# Altium project Schematic.PrjPcb
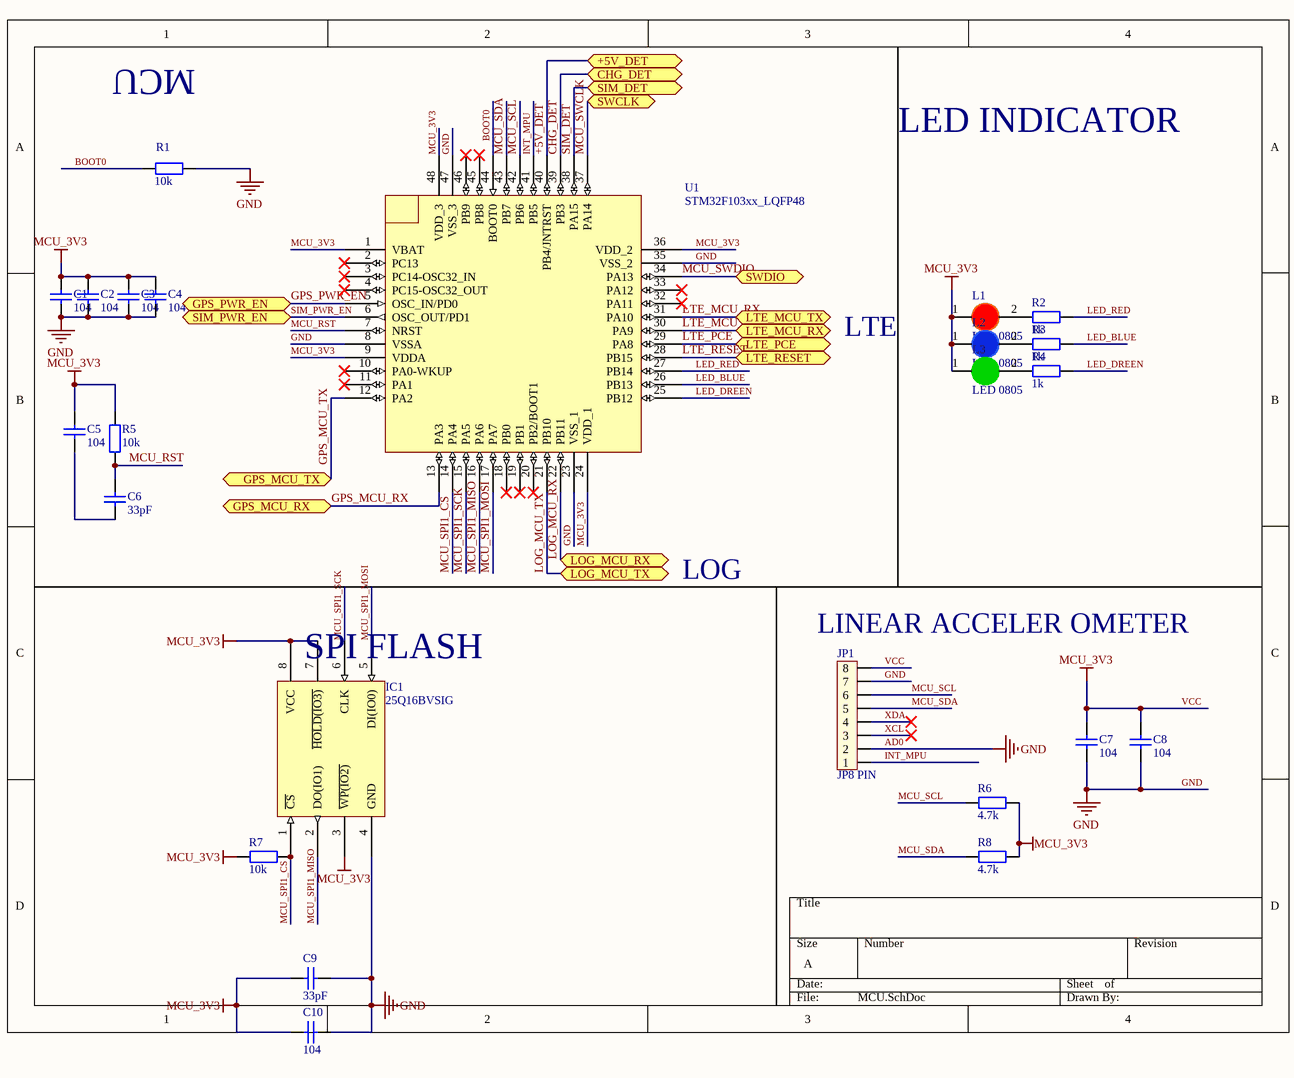
[diagram p0: MCU.SchDoc]
3 sheets, 85 parts. Net scope: flat (ports and power ports of the same name join across sheets).
Board file: PCB1.PcbDoc
Sheets:
  MCU.SchDoc
  LTE,GPS.SchDoc
  PSU - BUCK, LDO, CHARGER.SchDoc

## Sheet MCU.SchDoc
size A; SheetNumber: 1; SheetTotal: 3

### Parts
C1  104  [tu 0805]
C2  104  [tu 0805]
C3  104  [tu 0805]
C4  104  [tu 0805]
C5  104  [tu 0805]
C6  33pF  [tu 0805]
C7  104  [tu 0805]
C8  104  [tu 0805]
C9  33pF  [tu 0805]
C10  104  [tu 0805]
IC1  25Q16BVSIG  [SOP127P790X195-8N]
JP1  JP8 PIN  [JP8]
L1  LED 0805  [LED-0805-Red]
L2  LED 0805  [LED-0805-Blue]
L3  LED 0805  [LED-0805-Green]
R1  10k  [tro smd 0805]
R2  1k  [tro smd 0805]
R3  1k  [tro smd 0805]
R4  1k  [tro smd 0805]
R5  10k  [tro smd 0805]
R6  4.7k  [tro smd 0805]
R7  10k  [tro smd 0805]
R8  4.7k  [tro smd 0805]
U1  STM32F103xx_LQFP48  [STM32_LQPF48]

### Ports
+5V_DET (bidir), CHG_DET (bidir), GPS_MCU_RX (bidir), GPS_MCU_TX (bidir), GPS_PWR_EN (bidir), LOG_MCU_RX (bidir), LOG_MCU_TX (bidir), LTE_MCU_RX (bidir), LTE_MCU_TX (bidir), LTE_PCE (bidir), LTE_RESET (bidir), SIM_DET (bidir), SIM_PWR_EN (bidir), SWCLK (bidir), SWDIO (bidir)

### Nets
AD0: C1.1 C2.1 C3.1 C4.1 C7.1 C8.1 C9.2 C10.1 IC1.4(GND) JP1.2 JP1.7 R1.1 U1.8(VSSA) U1.23(VSS_1) U1.35(VSS_2) U1.47(VSS_3)  [also labelled GND]
MCU_3V3: C1.2 C2.2 C3.2 C4.2 C5.2 C7.2 C8.2 C9.1 C10.2 IC1.3(~{WP(IO2)}) IC1.7(~{HOLD(IO3)}) IC1.8(VCC) JP1.8 L1.1(A) L2.1(A) L3.1(A) R5.2 R6.2 R7.2 R8.2 U1.1(VBAT) U1.9(VDDA) U1.24(VDD_1) U1.36(VDD_2) U1.48(VDD_3)  [also labelled VCC]
+5V_DET: U1.40(PB4/JNTRST) ; port +5V_DET
BOOT0: R1.2 U1.44(BOOT0)
CHG_DET: U1.39(PB3) ; port CHG_DET
GPS_MCU_RX: U1.13(PA3) ; port GPS_MCU_RX
GPS_MCU_TX: U1.12(PA2) ; port GPS_MCU_TX
GPS_PWR_EN: U1.5(OSC_IN/PD0) ; port GPS_PWR_EN
INT_MPU: JP1.1 U1.41(PB5)
LED_BLUE: R3.2 U1.26(PB13)
LED_DREEN: R4.2 U1.25(PB12)
LED_RED: R2.2 U1.27(PB14)
LOG_MCU_RX: U1.22(PB11) ; port LOG_MCU_RX
LOG_MCU_TX: U1.21(PB10) ; port LOG_MCU_TX
LTE_MCU_RX: U1.31(PA10) ; port LTE_MCU_TX
LTE_MCU_TX: U1.30(PA9) ; port LTE_MCU_RX
LTE_PCE: U1.29(PA8) ; port LTE_PCE
LTE_RESET: U1.28(PB15) ; port LTE_RESET
MCU_RST: C6.1 R5.1 U1.7(NRST)
MCU_SCL: JP1.6 R6.1 U1.42(PB6)
MCU_SDA: JP1.5 R8.1 U1.43(PB7)
MCU_SPI1_CS: IC1.1(~{CS}) R7.1 U1.14(PA4)
MCU_SPI1_MISO: IC1.2(DO(IO1)) U1.16(PA6)
MCU_SPI1_MOSI: IC1.5(DI(IO0)) U1.17(PA7)
MCU_SPI1_SCK: IC1.6(CLK) U1.15(PA5)
MCU_SWCLK: U1.37(PA14) ; port SWCLK
MCU_SWDIO: U1.34(PA13) ; port SWDIO
SIM_DET: U1.38(PA15) ; port SIM_DET
SIM_PWR_EN: U1.6(OSC_OUT/PD1) ; port SIM_PWR_EN
XCL: JP1.3
XDA: JP1.4
NetC5_1: C5.1 C6.2
NetL1_2: L1.2(K) R2.1
NetL2_2: L2.2(K) R3.1
NetL3_2: L3.2(K) R4.1

Not connected (* = marked no-connect by the designer): U1 2(PC13)* 3(PC14-OSC32_IN)* 4(PC15-OSC32_OUT)* 10(PA0-WKUP)* 11(PA1)* 18(PB0)* 19(PB1)* 20(PB2/BOOT1)* 32(PA11)* 33(PA12)* 45(PB8)* 46(PB9)*

### Notes on the sheet
- MCU
- LED INDICATOR
- LTE
- LOG
- (near JP1) LINEAR ACCELER OMETER
- (near IC1) SPI FLASH

### Library data of the parts
C1-C5 C7 C8 C10 = Tu 0805 104 50V 10%: Dán; Don_Vi: Con; So_Chan: 2; Ten_Linh_Kien: Tụ 0805 104-100nF 10% 50V; Ma_Hang: MH004551; Chung_Loai: Dán; Kieu_Chan: *
C6 C9 = Tu 0805 33pF 50V 10%: Dán; Don_Vi: Con; So_Chan: 2; Ten_Linh_Kien: Tụ 0805 33p 10% 50V; Ma_Hang: MH004563; Chung_Loai: Dán; Kieu_Chan: *
JP1 = JP8: Value: JP7
L1 = LED 0805 Do: Dán; Don_Vi: Con; Ma_Hang: MH000897; Ten_Linh_Kien: LED 0805 Màu Đỏ (Red); Ghi_Chu: *; Kieu_Chan: *; Chung_Loai: Dán
L2 = LED 0805 Xanh Duong: Dán; Don_Vi: Con; Ma_Hang: MH002327; Ten_Linh_Kien: LED 0805 Màu Xanh Dương (Blue); Ghi_Chu: *; Kieu_Chan: *; Chung_Loai: Dán
L3 = LED 0805 Xanh La: Dán; Don_Vi: Con; Ma_Hang: MH002326; Ten_Linh_Kien: LED 0805 Màu Xanh Lá (Green); Ghi_Chu: *; Kieu_Chan: *; Chung_Loai: Dán
R1 R5 R7 = Tro 0805 5% 10k: Dán; Don_Vi: Con; So_Chan: 2; Ten_Linh_Kien: Trở 0805 5% 10k; Ma_Hang: MH005239; Chung_Loai: Dán; Kieu_Chan: *
R2-R4 = Tro 0805 5% 1k: Dán; Don_Vi: Con; So_Chan: 2; Ten_Linh_Kien: Trở 0805 5% 1k; Ma_Hang: MH005234; Chung_Loai: Dán; Kieu_Chan: *
R6 R8 = Tro 0805 5% 4.7k: Dán; Don_Vi: Con; So_Chan: 2; Ten_Linh_Kien: Trở 0805 5% 4.7k; Ma_Hang: MH005307; Chung_Loai: Dán; Kieu_Chan: *
U1 = STM32F103xx_LQFP48: Published: 30-May-2008; DatasheetVersion: rev6, Mar-2008; PackageVersion: Mar-2008; PackageReference: LQFP48; Publisher: Altium Limited; PackageDescription: 48-Pin Low-Profile Quad Flat Pack, 7 x 7 mm Body, 0.5 mm Pitch (LQFP48); ComponentLink1Description: Manufacturer Link; ComponentLink1URL: www.st.com/stm32; ComponentLink2Description: Datasheet; ComponentLink2URL: http://www.st.com/stonline/products/literature/ds/13587.pdf

## Sheet LTE,GPS.SchDoc
size A; SheetNumber: 2; SheetTotal: 3
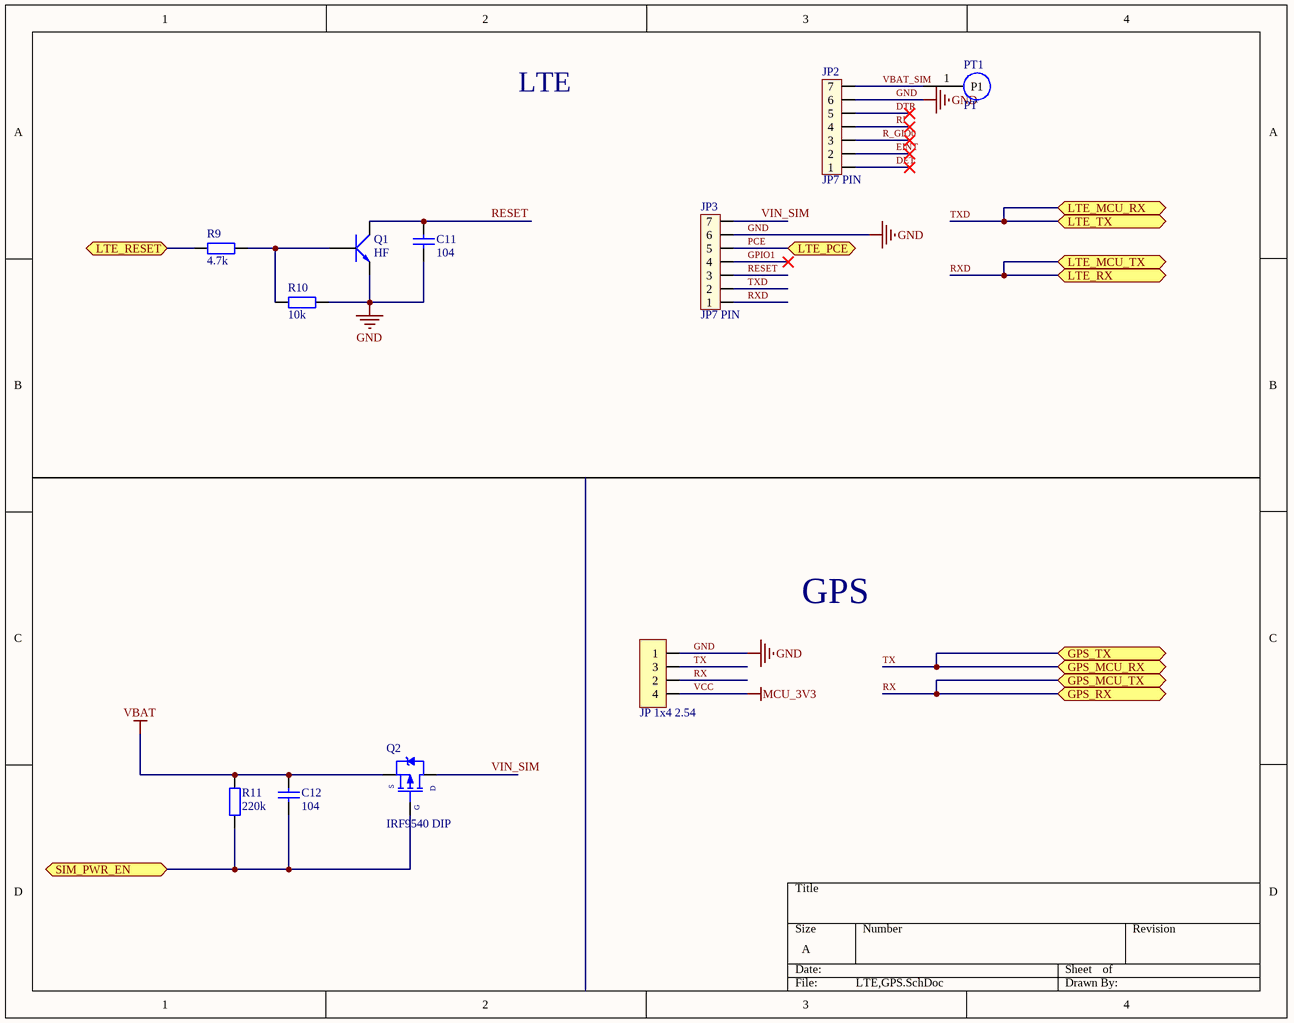
[diagram p1: LTE,GPS.SchDoc]

### Parts
C11  104  [tu 0805]
C12  104  [tu 0805]
JP2  JP7 PIN  [JP7]
JP3  JP7 PIN  [JP7]
JP4  JP 1x4 2.54  [JP 1x4 DC]
PT1  PT  [Test pont]  (no BOM)
Q1  HF  [SOT23]
Q2  IRF9540 DIP  [DPAK254P1511X469-3N]
R9  4.7k  [tro smd 0805]
R10  10k  [tro smd 0805]
R11  220k  [tro smd 0805]

### Ports
GPS_MCU_RX (bidir), GPS_MCU_TX (bidir), GPS_RX (bidir), GPS_TX (bidir), LTE_MCU_RX (bidir), LTE_MCU_TX (bidir), LTE_PCE (bidir), LTE_RESET (bidir), LTE_RX (bidir), LTE_TX (bidir), SIM_PWR_EN (bidir)

### Nets
GND: C11.1 JP2.6 JP3.6 JP4.1 Q1.2(E) R10.2  [project net AD0]
MCU_3V3: JP4.4  [also labelled VCC]
VBAT: C12.2 Q2.3(S) R11.2
DET: JP2.1
DTR: JP2.5
EINT: JP2.2
GPIO1: JP3.4
LTE_RESET: R9.1 ; port LTE_RESET
PCE: JP3.5 ; port LTE_PCE  [project net LTE_PCE]
R_GIO0: JP2.3
RESET: C11.2 JP3.3 Q1.3(C)
RI: JP2.4
RX: JP4.2 ; port GPS_MCU_TX, port GPS_RX  [project net GPS_MCU_TX]
RXD: JP3.1 ; port LTE_MCU_TX, port LTE_RX  [project net LTE_MCU_RX]
SIM_PWR_EN: C12.1 Q2.1(G) R11.1 ; port SIM_PWR_EN
TX: JP4.3 ; port GPS_MCU_RX, port GPS_TX  [project net GPS_MCU_RX]
TXD: JP3.2 ; port LTE_MCU_RX, port LTE_TX  [project net LTE_MCU_TX]
VBAT_SIM: JP2.7 PT1.1(P1)
VIN_SIM: JP3.7 Q2.2(D)
NetQ1_1: Q1.1(B) R9.2 R10.1

### Notes on the sheet
- LTE
- GPS

### Library data of the parts
C11 C12 = Tu 0805 104 50V 10%: as C1 on sheet MCU; Chung_Loai: Dán; Kieu_Chan: *
JP2 JP3 = JP7: Value: JP7
JP4 = JP 1x4 2.54 Duc Cong: Cắm; Ten_Linh_Kien: Jump Đơn Đực 2.54MM 1x40P Cong Đứng; Don_Vi: Con; Ma_Hang: MH000904; Ghi_Chu: *; Kieu_Chan: *; Chung_Loai: Cắm
PT1 = test pont
Q1 = C1815 HF SMD: NPN transistor; Value: C9014
Q2 = IRF9540 DIP: P-Channel Power MOSFET; Note: Pin 2 is electrically connected to pin 4.; Published: 8-Jun-2000; LatestRevisionDate: 17-Jul-2002; LatestRevisionNote: Re-released for DXP Platform.; DatasheetVersion: PD-9.421C; PackageVersion: Feb-1997; PackageReference: TO-220AB; Publisher: Altium Limited; PackageDescription: TO, Thru-Hole, Vertical, Heatsink Mounted; 3 In-Line Leads; Pitch 2.54 mm; ComponentLink1Description: Manufacturer Link; ComponentLink1URL: http://www.irf.com/; ComponentLink2Description: Datasheet; ComponentLink2URL: http://www.irf.com/product-info/datasheets/data/irf9540.pdf
R9 = Tro 0805 5% 4.7k: as R6 on sheet MCU; Chung_Loai: Dán; Kieu_Chan: *
R10 = Tro 0805 5% 10k: as R1 on sheet MCU; Chung_Loai: Dán; Kieu_Chan: *
R11 = Tro 0805 5% 220k: Dán; Don_Vi: Con; So_Chan: 2; Ten_Linh_Kien: Trở 0805 5% 220k; Ma_Hang: MH005258; Chung_Loai: Dán; Kieu_Chan: *

## Sheet PSU - BUCK, LDO, CHARGER.SchDoc
size A; SheetNumber: 3; SheetTotal: 3
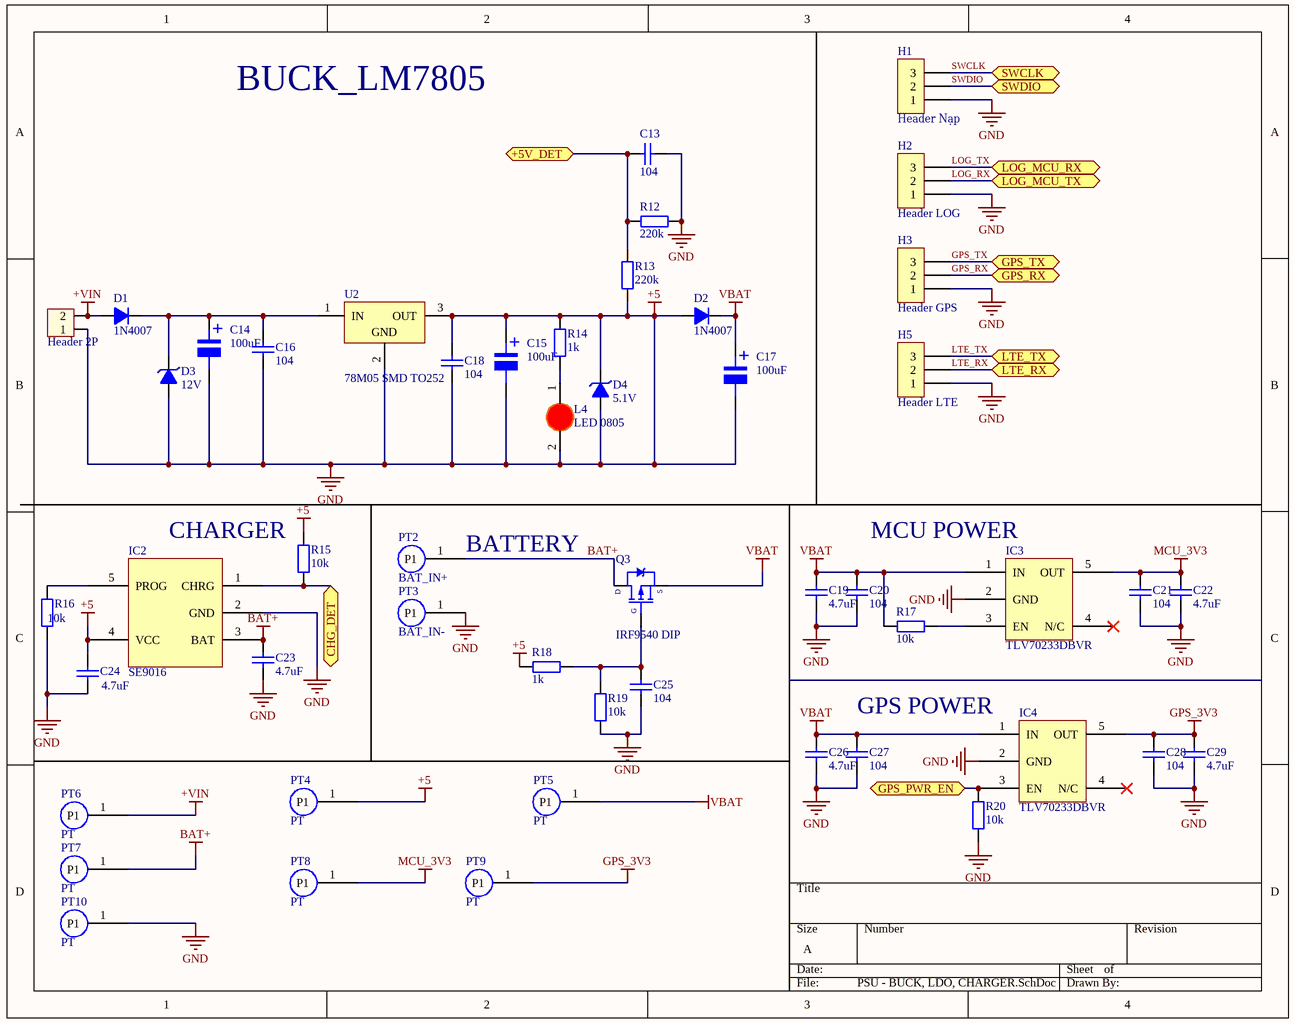
[diagram p2: PSU - BUCK, LDO, CHARGER.SchDoc]

### Parts
C13  104  [tu 0805]
C14  100uF  [tu nhom 6.3 (d)]
C15  100uF  [tu nhom 6.3 (d)]
C16  104  [tu 0805]
C17  100uF  [tu nhom 6.3 (d)]
C18  104  [tu 0805]
C19  4.7uF  [tu 0805]
C20  104  [tu 0805]
C21  104  [tu 0805]
C22  4.7uF  [tu 0805]
C23  4.7uF  [tu 0805]
C24  4.7uF  [tu 0805]
C25  104  [tu 0805]
C26  4.7uF  [tu 0805]
C27  104  [tu 0805]
C28  104  [tu 0805]
C29  4.7uF  [tu 0805]
D1  1N4007  [SODFL504X243-2N]
D2  1N4007  [SODFL504X243-2N]
D3  12V  [DIODE ZENNER SMD SOD80]
D4  5.1V  [DIODE ZENNER SMD SOD80]
H1  Header Nạp  [XH2.54M-3]
H2  Header LOG  [XH2.54M-3]
H3  Header GPS  [XH2.54M-3]
H4  Header 2P  [VH3.96M-2]
H5  Header LTE  [XH2.54M-3]
IC2  SE9016  [SOT95P280X110-5N]
IC3  TLV70233DBVR  [SOT95P280X145-5N]
IC4  TLV70233DBVR  [SOT95P280X145-5N]
L4  LED 0805  [LED-0805-Red]
PT2  BAT_IN+  [Test pont]  (no BOM)
PT3  BAT_IN-  [Test pont]  (no BOM)
PT4  PT  [Test pont]  (no BOM)
PT5  PT  [Test pont]  (no BOM)
PT6  PT  [Test pont]  (no BOM)
PT7  PT  [Test pont]  (no BOM)
PT8  PT  [Test pont]  (no BOM)
PT9  PT  [Test pont]  (no BOM)
PT10  PT  [Test pont]  (no BOM)
Q3  IRF9540 DIP  [DPAK254P1511X469-3N]
R12  220k  [tro smd 0805]
R13  220k  [tro smd 0805]
R14  1k  [tro smd 0805]
R15  10k  [tro smd 0805]
R16  10k  [tro smd 0805]
R17  10k  [tro smd 0805]
R18  1k  [tro smd 0805]
R19  10k  [tro smd 0805]
R20  10k  [tro smd 0805]
U2  78M05 SMD TO252  [TO252]

### Ports
+5V_DET (bidir), CHG_DET (bidir), GPS_PWR_EN (bidir), GPS_RX (bidir), GPS_TX (bidir), LOG_MCU_RX (bidir), LOG_MCU_TX (bidir), LTE_RX (bidir), LTE_TX (bidir), SWCLK (bidir), SWDIO (bidir)

### Nets
+5: C13.2 C14.2 C15.1 C15.2 C16.2 C17.2 C18.1 C18.2 C19.2 C20.2 C21.2 C22.2 C23.2 C24.1 C24.2 C25.2 C26.2 C27.2 C28.2 C29.2 D2.1(A) D3.1(A) D4.1(A) D4.2(K) H1.1 H2.1 H3.1 H4.1 H5.1 IC2.2(GND) IC2.4(VCC) IC3.2(GND) IC4.2(GND) L4.2(K) PT3.1(P1) PT4.1(P1) PT10.1(P1) R12.1 R13.1 R14.2 R15.2 R16.1 R18.1 R19.1 R20.1 U2.2(GND) U2.3(OUT)  [also labelled GND]  [project net AD0]
+VIN: D1.1(A) H4.2 PT6.1(P1)
BAT+: C23.1 IC2.3(BAT) PT2.1(P1) PT7.1(P1) Q3.2(D)
GPS_3V3: C28.1 C29.1 IC4.5(OUT) PT9.1(P1)
MCU_3V3: C21.1 C22.1 IC3.5(OUT) PT8.1(P1)
VBAT: C17.1 C19.1 C20.1 C26.1 C27.1 D2.2(K) IC3.1(IN) IC4.1(IN) PT5.1(P1) Q3.3(S) R17.1
+5V_DET: C13.1 R12.2 R13.2 ; port +5V_DET
CHG_DET: IC2.1(CHRG) R15.1 ; port CHG_DET
GPS_PWR_EN: IC4.3(EN) R20.2 ; port GPS_PWR_EN
GPS_RX: H3.2 ; port GPS_RX  [project net GPS_MCU_TX]
GPS_TX: H3.3 ; port GPS_TX  [project net GPS_MCU_RX]
LOG_RX: H2.2 ; port LOG_MCU_TX  [project net LOG_MCU_TX]
LOG_TX: H2.3 ; port LOG_MCU_RX  [project net LOG_MCU_RX]
LTE_RX: H5.2 ; port LTE_RX  [project net LTE_MCU_RX]
LTE_TX: H5.3 ; port LTE_TX  [project net LTE_MCU_TX]
SWCLK: H1.3 ; port SWCLK  [project net MCU_SWCLK]
SWDIO: H1.2 ; port SWDIO  [project net MCU_SWDIO]
NetC14_1: C14.1 C16.1 D1.2(K) D3.2(K) U2.1(IN)
NetC25_1: C25.1 Q3.1(G) R18.2 R19.2
NetIC2_5: IC2.5(PROG) R16.2
NetIC3_3: IC3.3(EN) R17.2
NetL4_1: L4.1(A) R14.1

Not connected (* = marked no-connect by the designer): IC3 4(N/C)*; IC4 4(N/C)*

### Notes on the sheet
- BUCK_LM7805
- CHARGER
- (near PT2) BATTERY
- MCU POWER
- (near C27) GPS POWER
- (in symbol Tu Nhom 100uF 25V) +

### Library data of the parts
C13 C16 C18 C20 C21 C25 C27 C28 = Tu 0805 104 50V 10%: as C1 on sheet MCU; Chung_Loai: Dán; Kieu_Chan: *
C14 C15 C17 = Tu Nhom 100uF 25V: Dán; Don_Vi: Con; So_Chan: 2; Ten_Linh_Kien: Tụ Nhôm 100uF 25V 6x7MM; Ma_Hang: MH002222; Chung_Loai: Dán; Kieu_Chan: *
C19 C22-C24 C26 C29 = Tu 0805 475 25V 20%: Dán; Don_Vi: Con; So_Chan: 2; Ten_Linh_Kien: Tụ 0805 475-4.7uF 20% 25V; Ma_Hang: MH004276; Chung_Loai: Dán; Kieu_Chan: *
D1 D2 = Diode 1N4007: Cắm; Ten_Linh_Kien: Diode 1N4007 1A (DIP); Don_Vi: Con; Ma_Hang: MH001063; Ghi Chu: *; Kieu_Chan: *; Chung_Loai: Cắm
D3 = Diode Zener 12V: Dán; Ma_Hang: MH000945; Don_Vi: Con; Ten_Linh_Kien: Diode Zener 1/2W 12V SMD1206 ZMM12; Kieu_Chan: *; Ghi_Chu: *; Chung_Loai: Dán
D4 = Diode Zener 5.1V: Dán; Ma_Hang: MH002881; Ten_Linh_Kien: Diode Zener 1/2W 5.1V SMD1206 ZMM5.1; Don_Vi: Con; Kieu_Chan: *; Ghi_Chu: *; Chung_Loai: Dán
H1-H3 H5 = Header 3P 2.54 Duc Thang: Cắm; Ten_Linh_Kien: Header 3P XH2.54-3P Đực Thẳng; Don_Vi: Con; Ma_Hang: MH001292; Chung_Loai: Cắm
H4 = Header 2P VH3.96 Duc Thang: Cắm; Ten_Linh_Kien: Header 2P XH2.54-2P Đực Thẳng; Don_Vi: Con; Ma_Hang: MH001283; Chung_Loai: Cắm
L4 = LED 0805 Do: as L1 on sheet MCU; Ghi_Chu: *; Kieu_Chan: *; Chung_Loai: Dán
PT2-PT10 = test pont
Q3 = IRF9540 DIP: as Q2 on sheet LTE,GPS; Published: 8-Jun-2000; LatestRevisionDate: 17-Jul-2002; LatestRevisionNote: Re-released for DXP Platform.; DatasheetVersion: PD-9.421C; PackageVersion: Feb-1997; PackageReference: TO-220AB; Publisher: Altium Limited; PackageDescription: TO, Thru-Hole, Vertical, Heatsink Mounted; 3 In-Line Leads; Pitch 2.54 mm; ComponentLink1Description: Manufacturer Link; ComponentLink1URL: http://www.irf.com/; ComponentLink2Description: Datasheet; ComponentLink2URL: http://www.irf.com/product-info/datasheets/data/irf9540.pdf
R12 R13 = Tro 0805 5% 220k: as R11 on sheet LTE,GPS; Chung_Loai: Dán; Kieu_Chan: *
R14 R18 = Tro 0805 1% 1k: Dán; Don_Vi: Con; So_Chan: 2; Ten_Linh_Kien: Trở 0805 1% 1k; Ma_Hang: MH005468; Chung_Loai: Dán; Kieu_Chan: *
R15-R17 R19 R20 = Tro 0805 5% 10k: as R1 on sheet MCU; Chung_Loai: Dán; Kieu_Chan: *
U2 = 78M05 SMD TO252: Dán; Don_Vi: Con; Ten_Linh_Kien: 78M05 TO252; Ma_Hang: MH001917; Ghi_Chu: *; Kieu_Chan: *; Chung_Loai: Dán

## Nets that join several sheets
AD0: MCU (16 pins), LTE,GPS (6 pins), PSU - BUCK, LDO, CHARGER (47 pins)
MCU_3V3: MCU (25 pins), LTE,GPS (JP4.4), PSU - BUCK, LDO, CHARGER (C21.1 C22.1 IC3.5 PT8.1)
VBAT: LTE,GPS (C12.2 Q2.3 R11.2), PSU - BUCK, LDO, CHARGER (11 pins)
+5V_DET: MCU (U1.40), PSU - BUCK, LDO, CHARGER (C13.1 R12.2 R13.2)
CHG_DET: MCU (U1.39), PSU - BUCK, LDO, CHARGER (IC2.1 R15.1)
GPS_MCU_RX: MCU (U1.13), LTE,GPS (JP4.3), PSU - BUCK, LDO, CHARGER (H3.3)
GPS_MCU_TX: MCU (U1.12), LTE,GPS (JP4.2), PSU - BUCK, LDO, CHARGER (H3.2)
GPS_PWR_EN: MCU (U1.5), PSU - BUCK, LDO, CHARGER (IC4.3 R20.2)
LOG_MCU_RX: MCU (U1.22), PSU - BUCK, LDO, CHARGER (H2.3)
LOG_MCU_TX: MCU (U1.21), PSU - BUCK, LDO, CHARGER (H2.2)
LTE_MCU_RX: MCU (U1.31), LTE,GPS (JP3.1), PSU - BUCK, LDO, CHARGER (H5.2)
LTE_MCU_TX: MCU (U1.30), LTE,GPS (JP3.2), PSU - BUCK, LDO, CHARGER (H5.3)
LTE_PCE: MCU (U1.29), LTE,GPS (JP3.5)
LTE_RESET: MCU (U1.28), LTE,GPS (R9.1)
MCU_SWCLK: MCU (U1.37), PSU - BUCK, LDO, CHARGER (H1.3)
MCU_SWDIO: MCU (U1.34), PSU - BUCK, LDO, CHARGER (H1.2)
SIM_PWR_EN: MCU (U1.6), LTE,GPS (C12.1 Q2.1 R11.1)